# Altium project RFID_Tag.PrjPcb
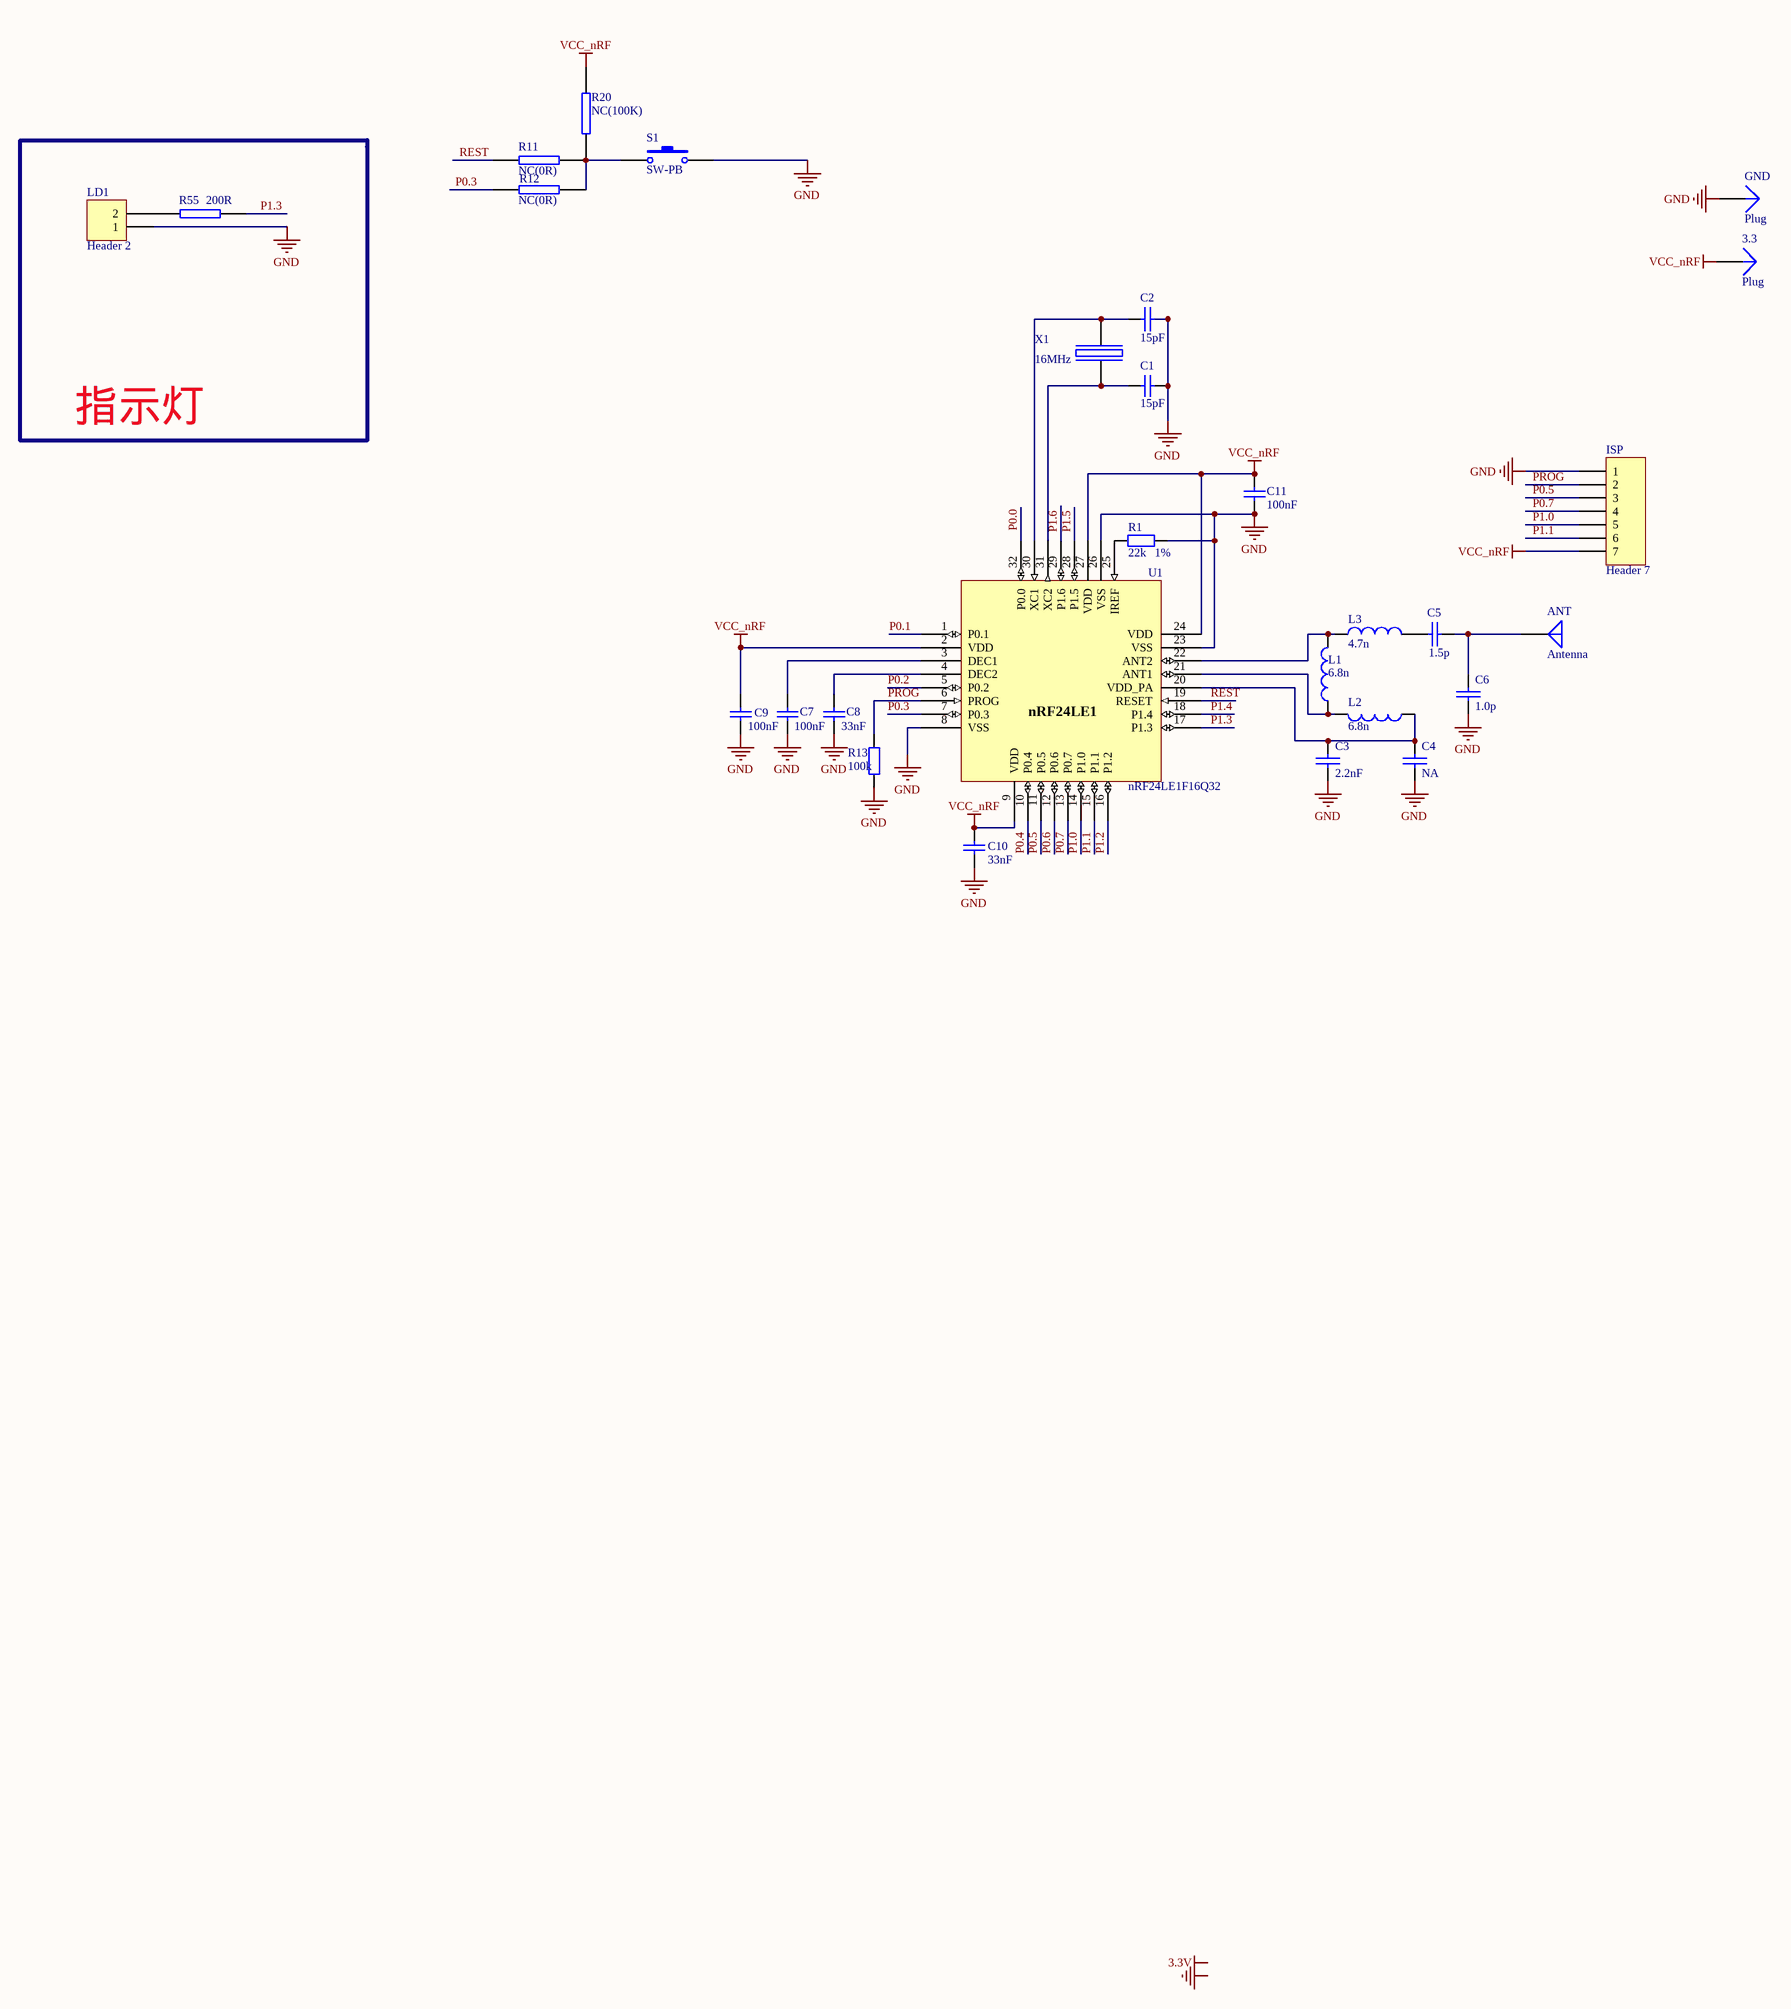
[diagram p0: RFID_Tag.SchDoc]
1 sheet, 28 parts. Net scope: global (net labels, ports and power ports of the same name join across sheets).
Board file: RFID_Tag.PcbDoc

## Sheet RFID_Tag.SchDoc
size 762 x 635 mm

### Parts
3.3  Plug  [CR2032电池座（正极）]
ANT  Antenna  [2.4G贴片天线]
C1  value 15pF  [0402s]  (hidden comment: NP0 50V)
C2  value 15pF  [0402s]  (hidden comment: NP0 50V)
C3  value 2.2nF  [0402s]  (hidden comment: X7R 16V)
C4  value NA  [0402s]  (hidden comment: NP0 50V)
C5  value 1.5p  [0402s]  (hidden comment: NP0 +/-0.1pF, 50V)
C6  value 1.0p  [0402s]  (hidden comment: NP0 +/-0.1pF, 50V)
C7  value 100nF  [0402s]  (hidden comment: X7R 16V)
C8  value 33nF  [0402s]  (hidden comment: X7R 16V)
C9  value 100nF  [0402s]  (hidden comment: X7R 16V)
C10  value 33nF  [0402s]  (hidden comment: X7R 16V)
C11  value 100nF  [0402s]  (hidden comment: X7R 16V)
GND  Plug  [CR2032电池座（负极）]
ISP  Header 7  [SIP7-127]
L1  value 6.8n  [0402s]  (hidden comment: Murata LQP15MN6N8B02D)
L2  value 6.8n  [0402s]  (hidden comment: Murata LQP15MN6N8B02D)
L3  value 4.7n  [0402s]  (hidden comment: Murata LQP15MN4N7B02D)
LD1  Header 2  [DYS0805LED]
R1  1%  value 22k  [0402s]
R11  NC(0R)  [0402s]
R12  NC(0R)  [0402s]
R13  value 100k  [0402s]
R20  NC(100K)  [0402s]
R55  200R  [0402s]
S1  SW-PB  [4x4x1.5贴片]
U1  value nRF24LE1F16Q32  [Nordic_QFN50P500X500X90-33N]  (hidden comment: QFN32 5x5 package)
X1  value 16MHz  [bt-xtal 3225]  (hidden comment: TSX-3225, 16MHz, Cl=9pF, +/-10ppm)

### Nets
GND: C1.1 C2.1 C3.1 C4.1 C6.2 C7.1 C8.1 C9.1 C10.1 C11.2 GND.1 ISP.1 LD1.1 R1.2 R13.1 S1.2 U1.8(VSS) U1.23(VSS) U1.26(VSS) X1.2(GND) X1.4(GND)
VCC_nRF: 3.3.1 C9.2 C10.2 C11.1 ISP.7 R20.2 U1.2(VDD) U1.9(VDD) U1.24(VDD) U1.27(VDD)
P0.0: U1.32(P0.0)
P0.1: U1.1(P0.1)
P0.2: U1.5(P0.2)
P0.3: R12.2 U1.7(P0.3)
P0.4: U1.10(P0.4)
P0.5: ISP.3 U1.11(P0.5)
P0.6: U1.12(P0.6)
P0.7: ISP.4 U1.13(P0.7)
P1.0: ISP.5 U1.14(P1.0)
P1.1: ISP.6 U1.15(P1.1)
P1.2: U1.16(P1.2)
P1.3: R55.2 U1.17(P1.3)
P1.4: U1.18(P1.4)
P1.5: U1.28(P1.5)
P1.6: U1.29(P1.6)
PROG: ISP.2 R13.2 U1.6(PROG)
REST: R11.2 U1.19(RESET)
NetANT_1: ANT.1(A) C5.1 C6.1
NetC1_2: C1.2 U1.31(XC2) X1.1(inp)
NetC2_2: C2.2 U1.30(XC1) X1.3(out)
NetC3_2: C3.2 C4.2 L2.1 U1.20(VDD_PA)
NetC5_2: C5.2 L3.2
NetC7_2: C7.2 U1.3(DEC1)
NetC8_2: C8.2 U1.4(DEC2)
NetL1_1: L1.1 L2.2 U1.21(ANT1)
NetL1_2: L1.2 L3.1 U1.22(ANT2)
NetLD1_2: LD1.2 R55.1
NetR1_1: R1.1 U1.25(IREF)
NetR11_1: R11.1 R12.1 R20.1 S1.1

### Notes on the sheet
- 指示灯
- Labels drawn without touching a wire or pin: 3.3V, GND
- (in symbol nRF24LE1 - 5x5) nRF24LE1

### Library data of the parts
ANT = Antenna: Generic Antenna; Published: 24-Mar-1999; LatestRevisionDate: 17-Jul-2002; LatestRevisionNote: Re-released for DXP Platform.; PackageReference: PIN1; Publisher: Altium Limited
C1 C7-C11 = Cap: Capacitor; Published: 8-Jun-2000; LatestRevisionDate: 17-Jul-2002; LatestRevisionNote: Re-released for DXP Platform.; PackageReference: RAD-0.3; Publisher: Altium Limited
C2-C6 = Cap: Capacitor; Part Field 1: 0402
ISP = Header 7: Header, 7-Pin; LatestRevisionDate: 17-Jul-2002; LatestRevisionNote: Re-released for DXP Platform.; Publisher: Altium Limited
L1-L3 = Inductor: Code_IEC: 1005; Published: 8-Jun-2000; LatestRevisionDate: 17-Jul-2002; LatestRevisionNote: Re-released for DXP Platform.; PackageReference: 0402-A; Publisher: Altium Limited; Code_JEITA: 0402
LD1 = Header 2: Header, 2-Pin; LatestRevisionDate: 17-Jul-2002; LatestRevisionNote: Re-released for DXP Platform.; Publisher: Altium Limited
R1 R13 = Res2: Resistor; Published: 8-Jun-2000; LatestRevisionDate: 17-Jul-2002; LatestRevisionNote: Re-released for DXP Platform.; PackageReference: AXIAL-0.4; Publisher: Altium Limited
R11 R12 R20 R55 = RES2
S1 = SW-PB: Switch; Published: 24-Mar-1999; LatestRevisionDate: 17-Jul-2002; LatestRevisionNote: Re-released for DXP Platform.; PackageReference: SPST-2; Publisher: Altium Limited; PackageDescription: Switch; 2 Leads
U1 = nRF24LE1 - 5x5: 2.4GHz Tranceiver with embedded MCU and 10 bit ADC
X1 = BT-XTAL: Crystal
3.3 GND = Plug: LatestRevisionDate: 17-Jul-2002; LatestRevisionNote: Re-released for DXP Platform.; Publisher: Altium Limited